# Altium schematic sheet COMPASS.SchDoc
size A
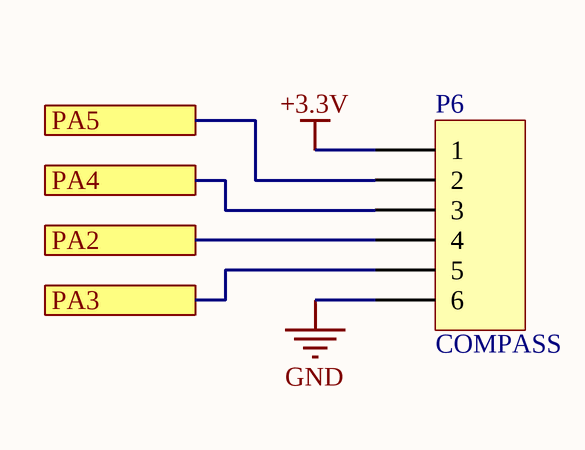
[diagram p0: COMPASS.SchDoc]

## Parts
P6  COMPASS  [HDR1X6]

## Ports
PA2, PA3, PA4, PA5

## Nets
+3.3V: P6.1
GND: P6.6
PA2: P6.4 ; port PA2
PA3: P6.5 ; port PA3
PA4: P6.3 ; port PA4
PA5: P6.2 ; port PA5

## Library data of the parts
P6 = Header 6: Header, 6-Pin; LatestRevisionDate: 17-Jul-2002; LatestRevisionNote: Re-released for DXP Platform.; Publisher: Altium Limited